# EAGLE design LPC_4TE_TOP_3_53d (EAGLE 5.04)

## Sheet 1 of 2
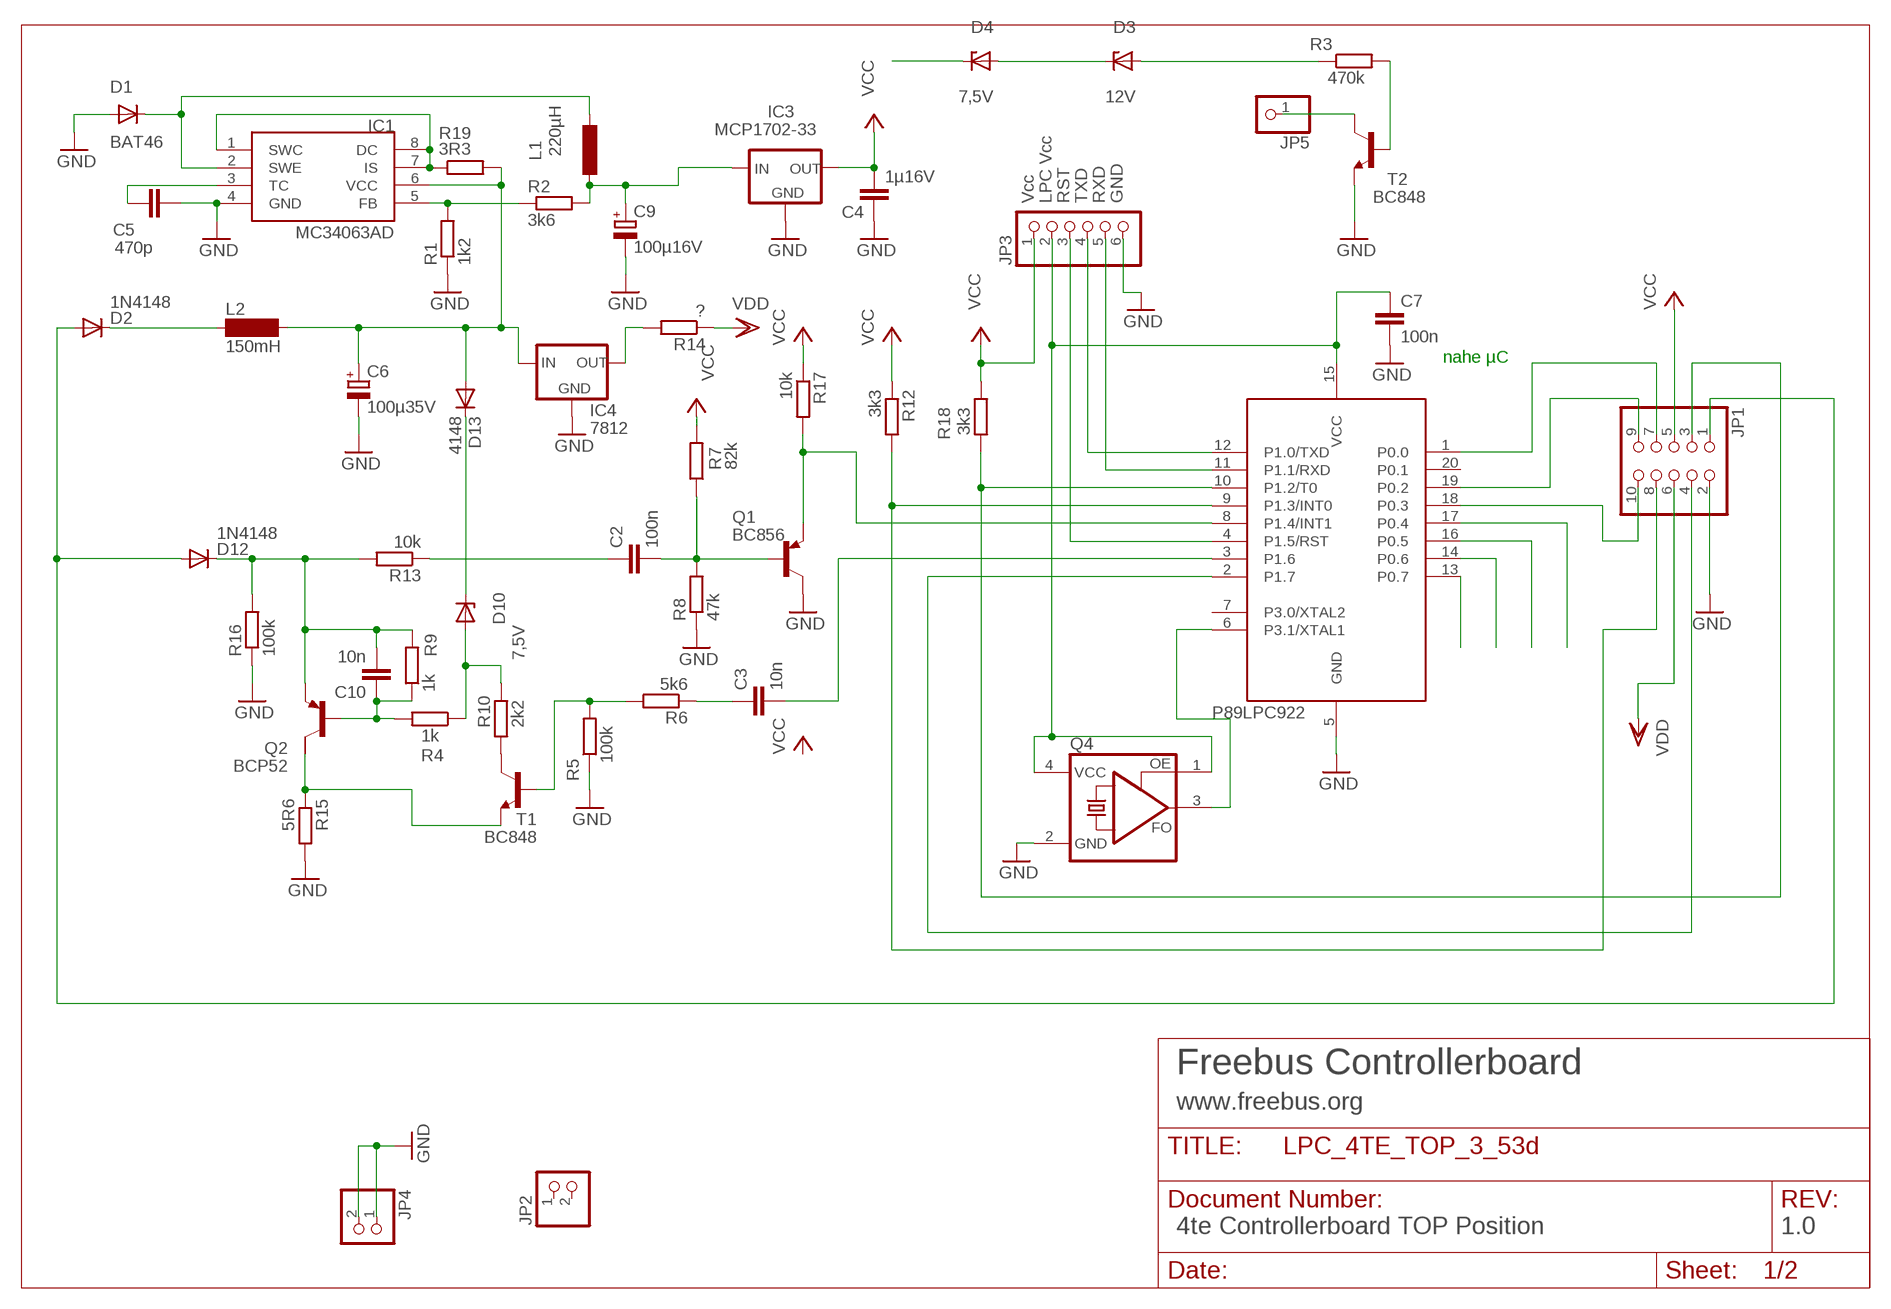
[diagram p0: schematic, sheet 1]

### Parts
C2  100n  C-EUC1206  [C1206]
C3  10n  C-EUC1206  [C1206]
C4  1µ16V  C-EUC1206  [C1206]
C5  470p  C-EUC1206  [C1206]
C6  100µ35V  CPOL-EUE5-8.5  [E5-8,5]
C7  100n  C-EUC1206  [C1206]
C9  100µ16V  CPOL-EUE2.5-5  [E2,5-5]
C10  10n  C-EUC1206  [C1206]
D1  BAT46  DIODE-MINIMELF  [MINIMELF]
D2  1N4148  DIODE-MINIMELF  [MINIMELF]
D3  12V  ZPD  [MINIMELF]
D4  7,5V  ZPD  [MINIMELF]
D10  7,5V  ZPD  [MINIMELF]
D12  1N4148  DIODE-MINIMELF  [MINIMELF]
D13  4148  DIODE-MINIMELF  [MINIMELF]
IC1  MC34063AD  [SOIC8]
IC3  MCP1702-33  79LXX  [79LXX]
IC4  7812  78XXS  [78XXS]
JP1  PINHD-2X5  [2X05]
JP2  PINHD-1X2  [1X02]
JP3  PINHD-1X6  [1X06]
JP4  PINHD-1X2  [1X02]
JP5  PINHD-1X1  [1X01]
L1  220µH  L-EU2200-11.43  [2200-11.43]
L2  150mH  SD12-1000  [SD12_1000]
Q1  BC856  BC856ALT1SMD  [SOT23-BEC]
Q2  BCP52  FZT753SMD  [SOT223]
Q4  ASFL  [ASF]
R1  1k2  R-EU_R1206  [R1206]
R2  3k6  R-EU_M1206  [M1206]
R3  470k  R-EU_R1206  [R1206]
R4  1k  R-EU_R1206  [R1206]
R5  100k  R-EU_R1206  [R1206]
R6  5k6  R-EU_R1206  [R1206]
R7  82k  R-EU_R1206  [R1206]
R8  47k  R-EU_M1206  [M1206]
R9  1k  R-EU_R1206  [R1206]
R10  2k2  R-EU_M1206  [M1206]
R12  3k3  R-EU_R1206  [R1206]
R13  10k  R-EU_R1206  [R1206]
R14  ?  R-EU_R1206  [R1206]
R15  5R6  R-EU_R1206  [R1206]
R16  100k  R-EU_M1206  [M1206]
R17  10k  R-EU_R1206  [R1206]
R18  3k3  R-EU_M1206  [M1206]
R19  3R3  R-EU_M1206  [M1206]
T1  BC848  [SOT23]
T2  BC848  [SOT23]
U1  89LPC922  [DIL20]

### Nets
DRAIN: R10.1 T1.3(C)
EIB+: D2.A D12.A JP1.1
EIB_DC: C6.+ D4.C D13.A IC1.6(VCC) IC4.IN L2.2 R19.2
EIB_SEND: C3.2 U1.3(P1.6)
EIBIN: Q1.E R17.2 U1.8(P1.4/INT1)
GATE: R5.2 R6.2 T1.1(B)
GND: C4.1 C5.2 C6.- C7.2 C9.- D1.A IC1.4(GND) IC3.GND IC4.GND JP1.2 JP3.6 JP4.1 JP4.2 Q1.C Q4.2(GND) R1.1 R5.1 R8.1 R15.2 R16.1 T2.2(E) U1.5(GND) ; also sheet 2
INT0: JP1.8 R12.2 U1.9(P1.3/INT0)
N$4: C10.1 Q2.1(B) R4.2 R9.1
N$5: C3.1 R6.1
N$6: C10.2 D12.C Q2.3(E) R9.2 R13.2 R16.2
N$7: Q2.2(C) R15.1 T1.2(E)
N$8: D2.C L2.1
N$9: JP3.5 U1.11(P1.1/RXD)
N$12: IC4.OUT R14.2
N$16: JP3.3 U1.4(P1.5/RST)
N$17: D3.C D4.A
N$19: D3.A R3.1
N$20: R3.2 T2.1(B)
N$21: JP5.1 T2.3(C)
N$24: JP3.4 U1.12(P1.0/TXD)
N$25: Q4.3(FO) U1.6(P3.1/XTAL1)
N$26: C9.+ IC3.IN L1.1 R2.2
N$31: C2.2 Q1.B R7.1 R8.2
N$50: IC1.5(FB) R1.2 R2.1
N$51: D1.C IC1.2(SWE) L1.2
N$52: C5.1 IC1.3(TC)
N$55: D10.A R4.1 R10.2
N$58: D10.C D13.C
N$63: IC1.1(SWC) IC1.7(IS) IC1.8(DC) R19.1
N$77: C2.1 R13.1
P0.0: JP1.7 U1.1(P0.0)
P0.2: JP1.9 U1.19(P0.2)
P0.3: JP1.10 U1.18(P0.3)
P04: U1.17(P0.4) ; also sheet 2
P05: U1.16(P0.5) ; also sheet 2
P06: U1.14(P0.6) ; also sheet 2
P07: U1.13(P0.7)
PROG: JP1.4 U1.2(P1.7)
PWM: JP1.3 R18.2 U1.10(P1.2/T0)
VCC: C4.2 IC3.OUT JP1.5 JP3.1 R7.2 R12.1 R17.1 R18.1 ; also sheet 2
VCC_LPC: C7.1 JP3.2 Q4.1(OE) Q4.4(VCC) U1.15(VCC)
VDD: JP1.6 R14.1
Unconnected: JP2.1 JP2.2 Q2.4(C/) U1.7(P3.0/XTAL2) U1.20(P0.1)

### Notes on the sheet
- Vcc | LPC Vcc | RST | TXD | RXD | GND
- nahe µC
- P89LPC922
- Freebus Controllerboard
- www.freebus.org
- 4te Controllerboard TOP Position | 1.0

## Sheet 2 of 2
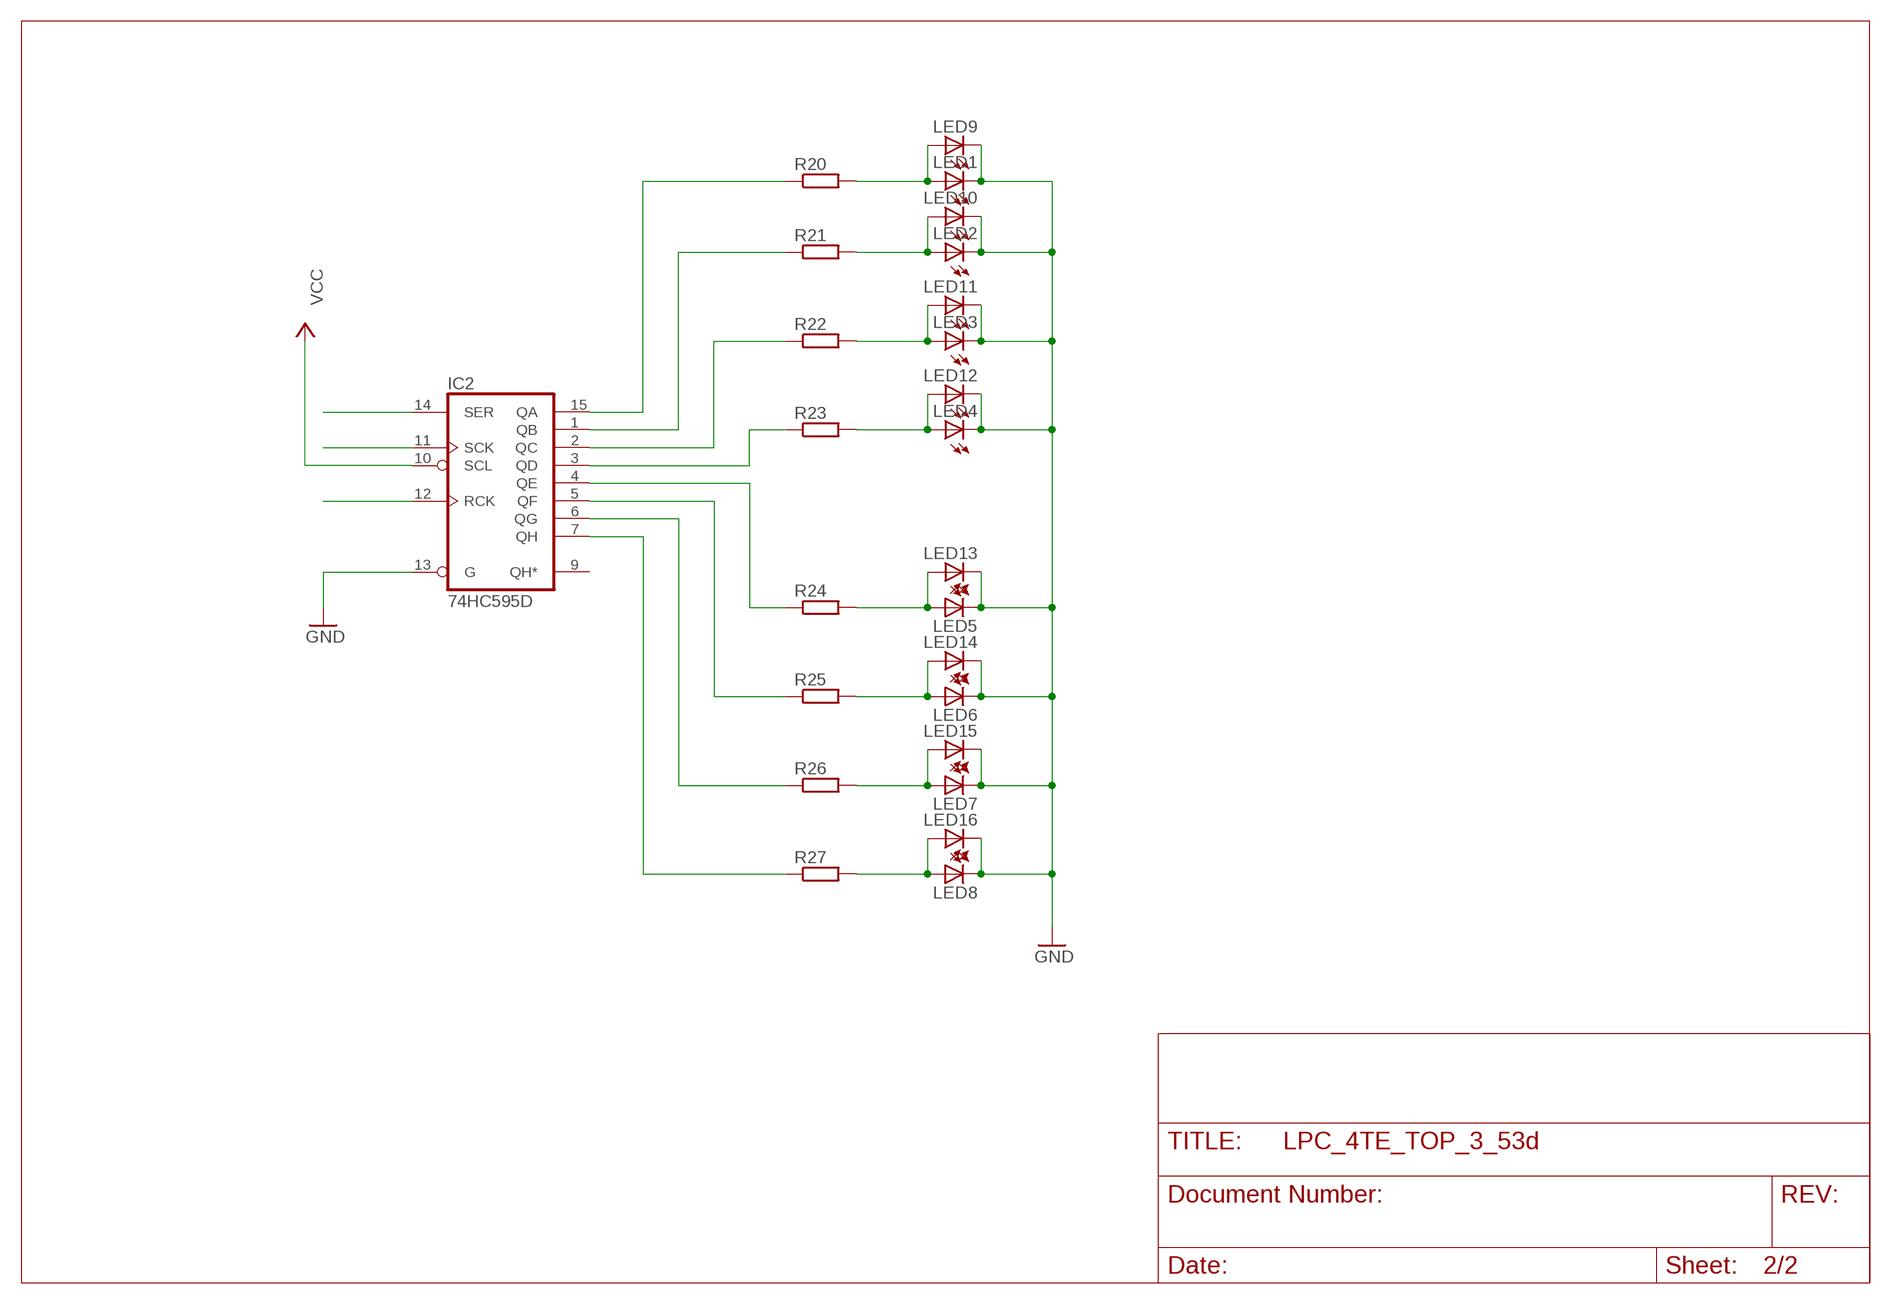
[diagram p1: schematic, sheet 2]

### Parts
IC2  74HC595D  [SO16]
LED1  LED3MM  [LED3MM]
LED2  LED3MM  [LED3MM]
LED3  LED3MM  [LED3MM]
LED4  LED3MM  [LED3MM]
LED5  LED3MM  [LED3MM]
LED6  LED3MM  [LED3MM]
LED7  LED3MM  [LED3MM]
LED8  LED3MM  [LED3MM]
LED9  LEDCHIPLED_1206  [CHIPLED_1206]
LED10  LEDCHIPLED_1206  [CHIPLED_1206]
LED11  LEDCHIPLED_1206  [CHIPLED_1206]
LED12  LEDCHIPLED_1206  [CHIPLED_1206]
LED13  LEDCHIPLED_1206  [CHIPLED_1206]
LED14  LEDCHIPLED_1206  [CHIPLED_1206]
LED15  LEDCHIPLED_1206  [CHIPLED_1206]
LED16  LEDCHIPLED_1206  [CHIPLED_1206]
R20  R-EU_R1206  [R1206]
R21  R-EU_R1206  [R1206]
R22  R-EU_R1206  [R1206]
R23  R-EU_R1206  [R1206]
R24  R-EU_R1206  [R1206]
R25  R-EU_R1206  [R1206]
R26  R-EU_R1206  [R1206]
R27  R-EU_R1206  [R1206]

### Nets
GND: IC2.13(G) LED1.K(C) LED2.K(C) LED3.K(C) LED4.K(C) LED5.K(C) LED6.K(C) LED7.K(C) LED8.K(C) LED9.C LED10.C LED11.C LED12.C LED13.C LED14.C LED15.C LED16.C ; also sheet 1
N$1: LED1.A LED9.A R20.2
N$2: LED2.A LED10.A R21.2
N$3: LED3.A LED11.A R22.2
N$10: LED4.A LED12.A R23.2
N$11: LED5.A LED13.A R24.2
N$13: LED6.A LED14.A R25.2
N$15: LED7.A LED15.A R26.2
N$18: LED8.A LED16.A R27.2
N$22: IC2.15(QA) R20.1
N$23: IC2.1(QB) R21.1
N$28: IC2.2(QC) R22.1
N$29: IC2.3(QD) R23.1
N$30: IC2.7(QH) R27.1
N$32: IC2.6(QG) R26.1
N$33: IC2.5(QF) R25.1
N$34: IC2.4(QE) R24.1
P04: IC2.14(SER) ; also sheet 1
P05: IC2.11(SCK) ; also sheet 1
P06: IC2.12(RCK) ; also sheet 1
VCC: IC2.10(SCL) ; also sheet 1
Unconnected: IC2.9(QH*)

## Power pins joined to a net without a drawn wire
GND: IC2.8(GND)
VCC: IC2.16(VCC)

## Library data of the parts
C2-C5 C7 C10 = rcl:C-EU: CAPACITOR, European symbol
C6 C9 = rcl:CPOL-EU: POLARIZED CAPACITOR, European symbol
D1 D2 D12 D13 = diode:DIODE-: DIODE
D3 D4 D10 = diode:ZPD: Z DIODE 500 mW
IC1 = mc34063:MC34063
IC2 = 74xx-eu:74*595: 8-bit SHIFT REGISTER, output latch
IC3 = v-reg:79LXX: VOLTAGE REGULATOR
IC4 = v-reg:78XXS: VOLTAGE REGULATOR
JP1 = pinhead:PINHD-2X5: PIN HEADER
JP2 JP4 = pinhead:PINHD-1X2: PIN HEADER
JP3 = pinhead:PINHD-1X6: PIN HEADER
JP5 = pinhead:PINHD-1X1: PIN HEADER
L1 = rcl:L-EU: INDUCTOR, European symbol
L2 = inductor-neosid:SD12: INDUCTOR nominal inductance
LED1-LED16 = led:LED: LED OSRAM: - CHIPLED LG R971, LG N971, LY N971, LG Q971, LY Q971, LO R971, LY R971 LH N974, LH R974 LS Q976, LO Q976, LY Q976 LO Q996 - Hyper CHIPLED LW Q18S LB Q993, LB Q99A, LB R99A - SideLED LS A670, LO A670, LY A670, LG A670, LP A670 LB A673, LV A673, LT A673, LW A673 LH A674 LY A675 LS A676, LA A676, LO A676, LY A676, LW A676 LS A679, LY A679, LG A679 - Hyper Micro SIDELED® LS Y876, LA Y876, LO Y876, LY Y876 LT Y87S - SmartLED LW L88C, LW L88S LB L89C, LB L89S, LG L890 LS L89K, LO L89K, LY L89K LS L896, LA L896, LO L896, LY L896 - TOPLED LS T670, LO T670, LY T670, LG T670, LP T670 LSG T670, LSP T670, LSY T670, LOP T670, LYG T670 LG T671, LOG T671, LSG T671 LB T673, LV T673, LT T673, LW T673 LH T674 LS T676, LA T676, LO T676, LY T676, LB T676, LH T676, LSB T676, LW T676 LB T67C, LV T67C, LT T67C, LS T67K, LO T67K, LY T67K, LW E67C LS E67B, LA E67B, LO E67B, LY E67B, LB E67C, LV E67C, LT E67C LW T67C LS T679, LY T679, LG T679 LS T770, LO T770, LY T770, LG T770, LP T770 LB T773, LV T773, LT T773, LW T773 LH T774 LS E675, LA E675, LY E675, LS T675 LS T776, LA T776, LO T776, LY T776, LB T776 LHGB T686 LT T68C, LB T68C - Hyper Mini TOPLED® LB M676 - Mini TOPLED Santana® LG M470 LS M47K, LO M47K, LY M47K Source: http://www.osram.convergy.de - LUMILED® LXK2-PW12-R00, LXK2-PW12-S00, LXK2-PW14-U00, LXK2-PW14-V00 LXK2-PM12-R00, LXK2-PM12-S00, LXK2-PM14-U00 LXK2-PE12-Q00, LXK2-PE12-R00, LXK2-PE12-S00, LXK2-PE14-T00, LXK2-PE14-U00 LXK2-PB12-K00, LXK2-PB12-L00, LXK2-PB12-M00, LXK2-PB14-N00, LXK2-PB14-P00, LXK2-PB14-Q00 LXK2-PR12-L00, LXK2-PR12-M00, LXK2-PR14-Q00, LXK2-PR14-R00 LXK2-PD12-Q00, LXK2-PD12-R00, LXK2-PD12-S00 LXK2-PH12-R00, LXK2-PH12-S00 LXK2-PL12-P00, LXK2-PL12-Q00, LXK2-PL12-R00 Source: www.luxeon.com
Q1 = transistor-pnp:BC856*: PNP Transistror
Q2 = transistor-pnp:FZT753SMD: PNP Transistor
Q4 = crystal:ASF*: CRYSTAL CLOCK OSCILLATORS 5.0 Vdc or 3.3 Vdc - LOW PROFILE ULTRA MINIATURE CERAMIC SURFACE MOUNT Source: http://www.abracon.com/Oscillators/asf1-L-L1.pdf
R1-R10 R12-R27 = rcl:R-EU_: RESISTOR, European symbol
T1 T2 = transistor:BC848: NPN TRANSISTOR
U1 = micro-philips:89LPC922

## Board
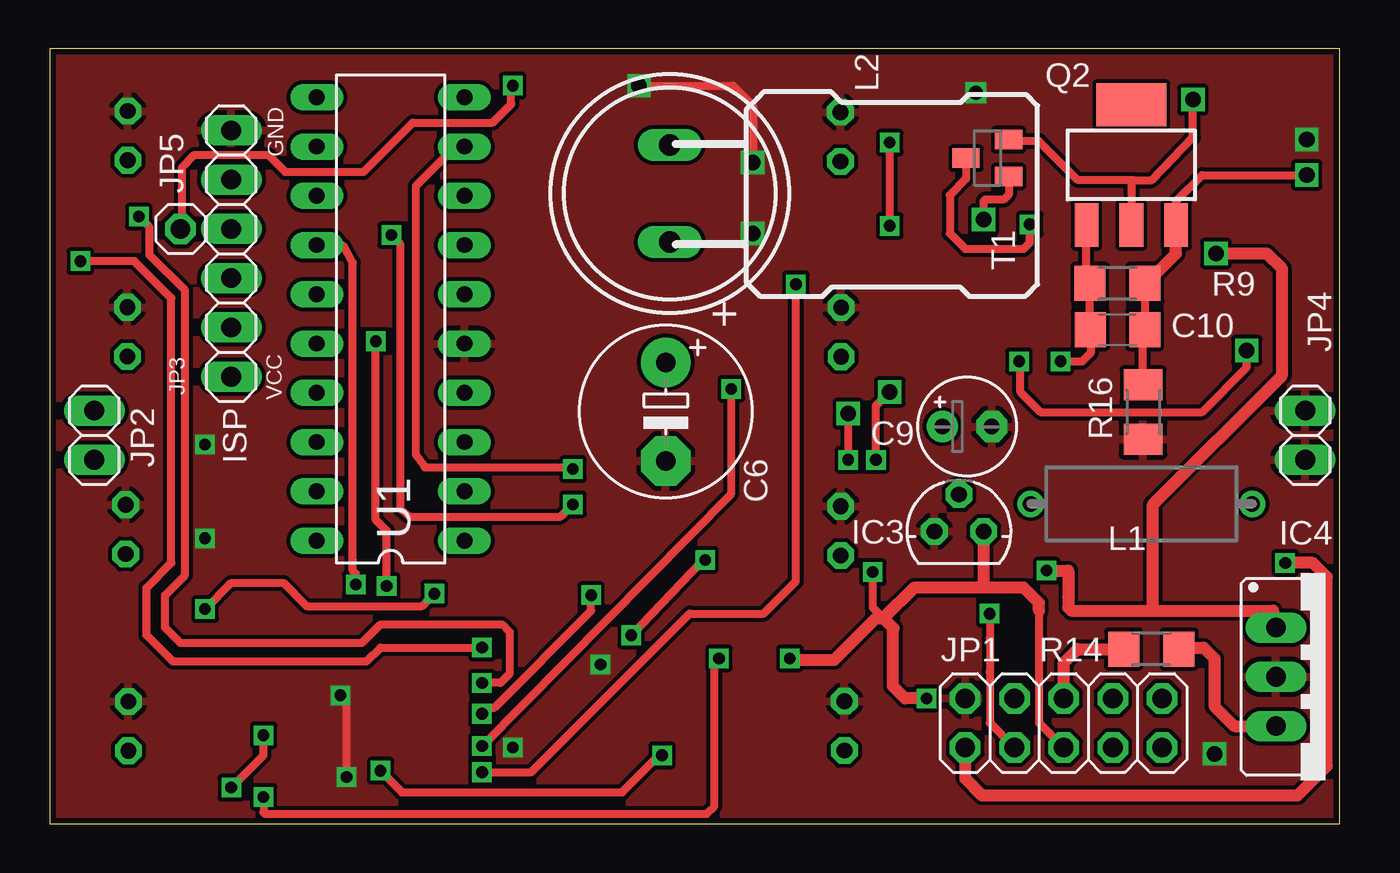
[diagram p2: board, top side]
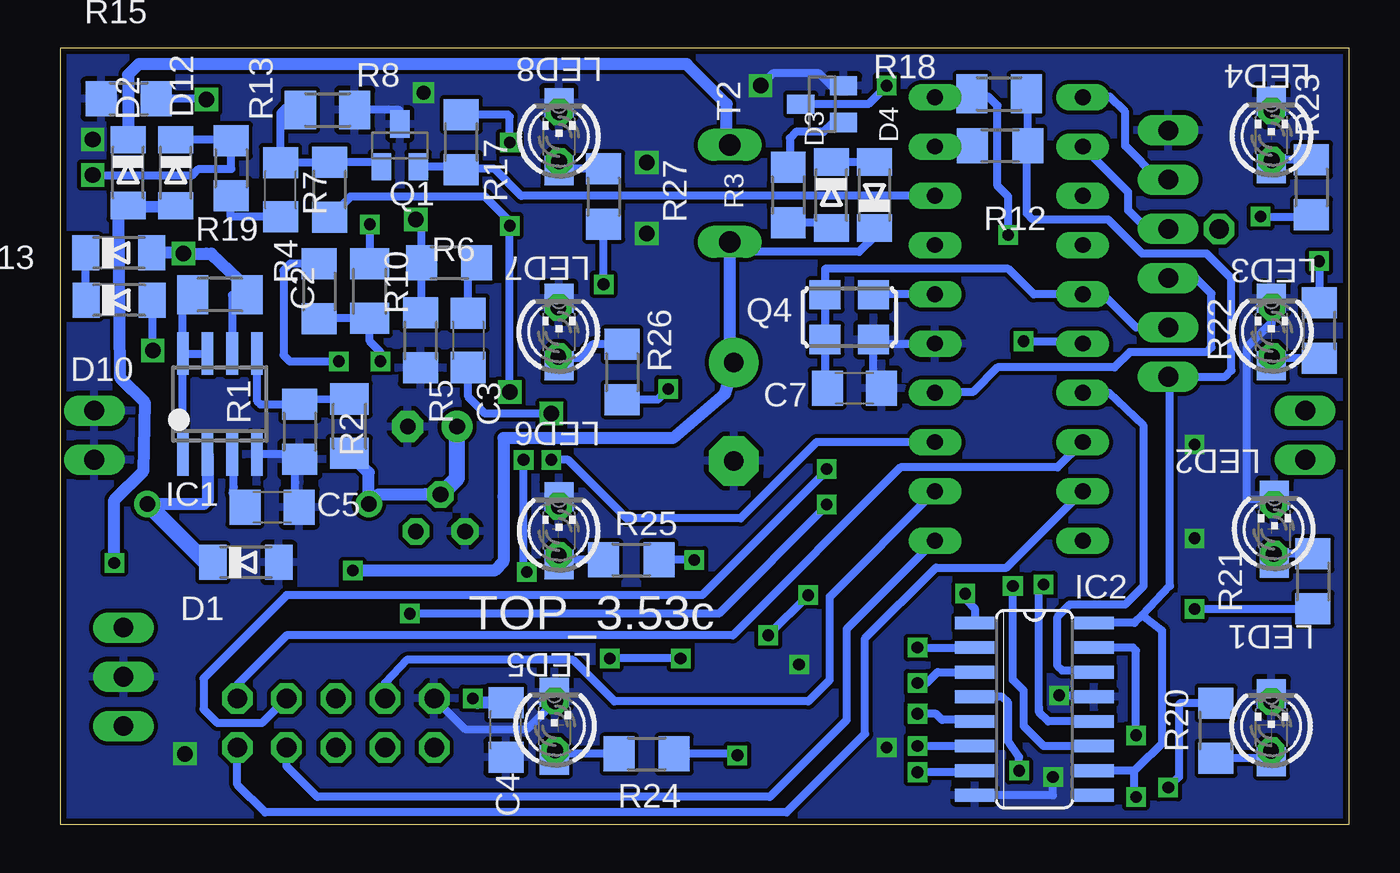
[diagram p3: board, bottom side, seen from below]

Size 66.5 x 40 mm. Coordinates in mm from the lower left corner, seen from the top.
Outline: 0,40 66.5,40 66.5,0 0,0 0,40
Copper layers (1*16): Top 0.035mm / dielectric 1.5mm / Bottom 0.035mm
Design rules: minimum track width 10mil, minimum drill 24mil, track to track 8mil, track to pad 8mil, pad to pad 8mil, via to via 8mil, smd to smd 8mil, copper to edge 12mil, drill to drill 8mil, minimum pad ring 11mil, minimum via ring 8mil, stop-mask expansion 4mil, vias tented up to drill 0mil, thermal gap 10mil

### Footprints (pad centres in the part's own frame; a part is rotated, then mirrored left to right if it is on the bottom)
C1206 = smd 1.6 x 1.8: 1 -1.4,0; 2 1.4,0
E5-8,5 = drill 1.016 pad 2.54: + -2.54,0 | drill 1.016 pad 2.54 octagon: - 2.54,0
E2,5-5 = drill 0.813 pad 1.6: + -1.27,0 | drill 0.813 pad 1.6 octagon: - 1.27,0
MINIMELF = smd 1.4 x 1.8: A 1.7,0; C -1.7,0
SOIC8 = smd 0.6 x 2.2: 1 -1.905,-2.6; 2 -0.635,-2.6; 3 0.635,-2.6; 4 1.905,-2.6; 5 1.905,2.6; 6 0.635,2.6; 7 -0.635,2.6; 8 -1.905,2.6
SO16 = smd 0.66 x 2.032: 1 -4.445,-3.073; 2 -3.175,-3.073; 3 -1.905,-3.073; 4 -0.635,-3.073; 5 0.635,-3.073; 6 1.905,-3.073; 7 3.175,-3.073; 8 4.445,-3.073; 9 4.445,3.073; 10 3.175,3.073; 11 1.905,3.073; 12 0.635,3.073; 13 -0.635,3.073; 14 -1.905,3.073; 15 -3.175,3.073; 16 -4.445,3.073
79LXX = drill 0.813 octagon: GND -1.27,0; IN 0,1.905; OUT 1.27,0
78XXS = drill 1.016 long: GND 0,-2.54; IN -2.54,-2.54; OUT 2.54,-2.54
2X05 = drill 1.016 octagon: 1 -5.08,-1.27; 2 -5.08,1.27; 3 -2.54,-1.27; 4 -2.54,1.27; 5 0,-1.27; 6 0,1.27; 7 2.54,-1.27; 8 2.54,1.27; 9 5.08,-1.27; 10 5.08,1.27
1X02 = drill 1.016 long: 1 -1.27,0; 2 1.27,0
1X06 = drill 1.016 long: 1 -6.35,0; 2 -3.81,0; 3 -1.27,0; 4 1.27,0; 5 3.81,0; 6 6.35,0
1X01 = drill 1.016 octagon: 1 0,0
2200-11.43 = drill 0.8 pad 1.27: 1 -5.715,0; 2 5.715,0
SD12_1000 = drill 1.1 long: 1 -2.5,0; 2 2.5,0
LED3MM = drill 0.813 octagon: A -1.27,0; K 1.27,0
CHIPLED_1206 = smd 1.5 x 1.5: A 0,-1.75; C 0,1.75
SOT23-BEC = smd 1 x 1.4: B -0.95,-1.1; C 0,1.1; E 0.95,-1.1
SOT223 = smd 1.219 x 2.235: 1 -2.311,-3.099; 2 0,-3.099; 3 2.311,-3.099 | smd 3.6 x 2.2: 4 0,3.099
ASF = smd 1.6 x 1.5: 1 -1.25,-1.15; 2 1.25,-1.15; 3 1.25,1.15; 4 -1.25,1.15
R1206 = smd 1.6 x 1.803: 1 -1.422,0; 2 1.422,0
M1206 = smd 1.6 x 2: 1 -1.4,0; 2 1.4,0
SOT23 = smd 1 x 1.4: 1 -0.95,-1.1; 2 0.95,-1.1; 3 0,1.1
DIL20 = drill 0.813 long: 1 -11.43,-3.81; 2 -8.89,-3.81; 3 -6.35,-3.81; 4 -3.81,-3.81; 5 -1.27,-3.81; 6 1.27,-3.81; 7 3.81,-3.81; 8 6.35,-3.81; 9 8.89,-3.81; 10 11.43,-3.81; 11 11.43,3.81; 12 8.89,3.81; 13 6.35,3.81; 14 3.81,3.81; 15 1.27,3.81; 16 -1.27,3.81; 17 -3.81,3.81; 18 -6.35,3.81; 19 -8.89,3.81; 20 -11.43,3.81

### Placement (x,y rotation side)
C2  55.13,32.72 90 bottom
C3  45.45,24.95 270 bottom
C4  43.5,4.86 90 bottom
C5  55.56,16.35 0 bottom
C6  31.75,21.27 270 top
C7  25.53,22.49 0 bottom
C9  47.3,20.51 0 top
C10  55.05,25.51 0 top
D1  56.92,13.5 0 bottom
D2  62.99,33.6 270 bottom
D3  26.72,32.44 270 bottom
D4  24.5,32.44 90 bottom
D10  63.46,27.03 0 bottom
D12  60.53,33.59 270 bottom
D13  63.47,29.46 0 bottom
IC1  58.26,21.67 0 bottom
IC2  16.24,5.93 270 bottom
IC3  46.88,15.1 0 top
IC4  65.77,7.6 270 top
JP1  52.28,5.22 0 top
JP2  2.27,20.06 90 top
JP3  9.34,29.43 90 top
JP4  64.74,20.06 90 top
JP5  6.72,30.7 0 top
L1  56.29,16.52 0 top
L2  31.96,32.53 270 top
LED1  4.03,5.06 90 bottom
LED2  3.89,15.2 90 bottom
LED3  3.98,25.39 90 bottom
LED4  4,35.5 90 bottom
LED5  40.97,5.07 90 bottom
LED6  40.78,15.13 90 bottom
LED7  40.8,25.38 90 bottom
LED8  40.77,35.45 90 bottom
LED9  4.02,4.98 0 bottom
LED10  3.86,15.22 0 bottom
LED11  4.02,25.38 0 bottom
LED12  4.02,35.54 0 bottom
LED13  41.01,5.06 0 bottom
LED14  40.77,15.14 0 bottom
LED15  40.77,25.38 0 bottom
LED16  40.77,35.46 0 bottom
Q1  48.97,35 0 bottom
Q2  55.77,34 0 top
Q4  25.79,26.14 0 bottom
R1  54.13,20.24 90 bottom
R2  51.58,20.53 270 bottom
R3  28.94,32.44 90 bottom
R4  53.14,27.48 90 bottom
R5  47.91,24.95 90 bottom
R6  46.43,28.95 180 bottom
R7  52.59,32.72 270 bottom
R8  52.71,36.83 180 bottom
R9  55.05,27.89 0 top
R10  50.53,27.49 270 bottom
R12  18.01,34.99 180 bottom
R13  57.67,33.83 90 bottom
R14  56.8,9.03 0 top
R15  62.97,37.4 180 bottom
R16  56.37,21.25 90 top
R17  45.81,35.17 270 bottom
R18  18.06,37.66 180 bottom
R19  58.26,27.31 0 bottom
R20  6.87,4.82 270 bottom
R21  1.87,12.52 90 bottom
R22  1.56,25.46 270 bottom
R23  1.95,32.84 90 bottom
R24  36.24,3.63 180 bottom
R25  37.04,13.63 180 bottom
R26  37.51,23.32 90 bottom
R27  38.47,32.36 90 bottom
T1  48.34,34.35 90 top
T2  27.19,37.13 90 bottom
U1  17.56,26.05 90 top

### Tracks (layer width: path | path; a pad name or v marks a point on that pad's centre or on a via)
DRAIN  (via drill 0.6)
  Top 0.406: T1.3 47.24,33.28 46.4,32.44 46.4,30.46 47.2,29.67 50.21,29.67 50.53,29.98 v50.53,30.94
  Bottom 0.406: v50.53,30.94 R10.1
EIB+  (via drill 0.6)
  Top 0.61: JP1.1 47.2,2.36 48.07,1.49 64.34,1.49 65.85,3 65.85,12.76 65.14,13.47 v63.71,13.47 63.87,13.31
  Bottom 0.61: D12.A 60.68,31.82 D2.A 63.47,31.74 63.39,23 62.12,21.73 62.2,18.24 63.71,16.73 v63.71,13.47
EIB_DC  (via drill 0.6, 0.8)
  Top 0.61: v51.4,13.08 52.52,13.08 52.52,11.73 52.52,11.17 52.67,11.01 56.88,11.01 | 56.88,11.01 63.07,11.01 IC4.IN | 56.88,11.01 56.88,16.49 63.55,23.16 63.55,28.63 62.75,29.43 v60.14,29.43
  Bottom 0.406: IC1.6 57.63,27.28 R19.2 | D4.C 24.5,30.3 25.29,29.51 31.44,29.51 L2.2 | D13.A 61.37,29.46 61.25,29.59
  Bottom 0.61: R19.2 56.86,27.66 58.71,29.43 58.94,29.43 v60.14,29.43 60.17,29.46 D13.A | L2.2 31.96,23.68 C6.+ 32.23,22.17 34.89,19.9 43.63,19.9 43.63,16.89 43.63,13.55 44.1,13.08 v51.4,13.08
EIB_SEND  (via drill 0.6, 0.8)
  Top 0.406: v41.16,18.79 v41.16,21.17
  Bottom 0.406: U1.3 27.47,19.7 31.4,15.78 37.28,15.78 40.29,18.79 v41.16,18.79 | v41.16,21.17 44.58,21.17 45.45,22.05 45.45,23.23 C3.2
EIBIN
  Bottom 0.406: Q1.E 45.96,33.9 R17.2 | R17.2 45.42,33.75 | U1.8 42.71,32.4 44.1,33.79 45.76,33.79 R17.2
GATE  (via drill 0.8)
  Top 0.406: T1.1 49.44,32.47 49.18,32.21 48.23,32.21 48.15,32.13 v48.15,31.17
  Bottom 0.406: v48.15,31.17 47.85,31 R6.2 47.85,26.79 R5.2
GND  (via drill 0.6, 0.7, 0.8)
  Top 0.406: v14.97,6.65 15.29,6.09 v15.29,2.44 | v30.37,38.08 35.21,38.08 36.24,37.05 v36.24,34.11
  Bottom 0.406: C5.2 54.4,16.72 54.37,17.62 54.37,18.9 R1.1 | IC1.4 54.38,19.07 R1.1 | R1.1 53.98,19.29 | R8.1 49.01,36.83 49.02,36.77 49.02,36.15 Q1.C | 4.02,25.86 3.94,26.33 4.02,26.41 4.02,25.86 | 4.02,25.86 3.91,26.73 LED3.K | LED2.K 3.89,16.76 5.29,16.73 5.29,24.59 4.02,25.86 | LED2.K 3.89,16.44 | LED1.K 3.95,6.41 | U1.5 24.33,24.78 Q4.2 24.54,22.5 C7.2 | 41.11,6.49 LED5.K 42.41,4.9 45.61,4.9 JP1.2 | LED9.C 4.02,6.89 4.03,6.9 | LED10.C 3.86,16.5 LED2.K | IC2.13 13.25,6.65 v14.97,6.65 | v15.29,2.44 15.29,1.49 IC2.8 | T2.2 26.72,38.08 27.35,38.71 29.73,38.71 v30.37,38.08 | JP1.2
  other vias: 47.75,37.72 36.24,30.46 60.06,3.63 64.82,35.3 7.99,19.59 7.99,14.74 23.86,3.95 28.39,8.23
  pour Top: -0.75,41.33 66.25,41.33 67.76,39.83 67.76,0.38 66.33,-1.05 -0.51,-1.05 -1.14,-0.42
  pour Bottom: -0.98,42.68 67.28,42.68 68.31,41.65 68.31,0.38 66.8,-1.13 -0.9,-1.13 -1.38,-0.66
INT0  (via drill 0.6)
  Top 0.406: U1.9 20.88,34.94 18.86,32.92 18.86,19.03 19.34,18.39 26.72,18.39 v26.96,18.32
  Bottom 0.406: R12.2 21.34,34.91 U1.9 | v26.96,18.32 26.96,18.24 33.39,11.81 54.82,11.81 59.1,7.52 59.1,5.93 58.39,5.22 56.09,5.22 JP1.8
N$1
  Bottom 0.406: LED9.A 4.02,3.77 LED1.A 4.42,3.4 R20.2
N$2
  Bottom 0.406: LED10.A 3.86,13.9 LED2.A 3.88,13.94 R21.2
N$3
  Bottom 0.406: LED11.A 4.02,24.08 LED3.A 3.9,24.04 R22.2
N$4  (via drill 0.6)
  Top 0.406: Q2.1 53.46,28.06 R9.1 53.63,25.53 C10.1 53.71,25.45 53.71,24.35 53.23,23.87 v52.12,23.87
  Bottom 0.406: R4.2 54.63,28.9 54.98,28.55 54.98,24.19 54.66,23.87 v52.12,23.87
N$5
  Bottom 0.406: R6.1 45.45,28.84 C3.1
N$6  (via drill 0.8)
  Top 0.406: R9.2 56.48,25.53 C10.2 56.37,25.42 R16.2 | v64.82,33.48 59.42,33.48 58.07,32.13 58.07,31.97 58.08,31.96 Q2.3
  Top 0.61: R9.2 56.53,27.89 58.07,29.43 Q2.3
  Bottom 0.406: D12.C 57.79,35.29 57.67,35.5 R13.2 57.67,33.8 57.67,33.79 59.34,33.79 59.66,33.48 v64.82,33.48
N$7  (via drill 0.8)
  Top 0.406: Q2.2 55.77,33.14 55.85,33.22 | 55.85,33.22 56.82,33.22 58.94,35.42 v58.94,37.37 | 55.85,33.22 53.01,33.22 51.01,35.22 49.52,35.22 T1.2
  Bottom 0.406: v58.94,37.37 58.98,37.4 R15.1
N$8
  Bottom 0.61: D2.C 62.99,38.63 62.44,39.19 34.18,39.19 32.12,37.13 32.12,35.18 L2.1
N$9
  Bottom 0.406: JP3.5 9.81,33.24 11.56,34.98 11.56,36.73 12.35,37.52 13.71,37.52 U1.11
N$10
  Bottom 0.406: LED12.A 4.02,34.22 LED4.A 3.97,34.26 R23.2
N$11
  Bottom 0.406: LED13.A 41.01,3.76 LED5.A 40.8,3.63 R24.2
N$12
  Top 0.61: IC4.OUT 61.09,5.06 60.06,6.09 60.06,8.55 59.5,9.11 58.3,9.11 R14.2
N$13
  Bottom 0.406: LED14.A 40.77,13.85 LED6.A 40.55,13.63 R25.2
N$15
  Bottom 0.406: LED15.A 40.77,24.07 LED7.A 40.72,24.03 39.74,24.03 39.03,24.74 R26.2
N$16
  Bottom 0.406: JP3.3 7.91,28.16 7.11,27.36 7.11,24.59 7.35,24.35 11.32,24.35 12.11,23.55 18.15,23.55 19.42,22.28 21.33,22.28 U1.4
N$17
  Bottom 0.406: D4.A D3.C | D4.A
N$18
  Bottom 0.406: LED8.A LED16.A 40.69,33.79 R27.2
N$19
  Bottom 0.406: R3.1 27,31.02 D3.A
N$20
  Bottom 0.406: R3.2 28.86,33.95 28.86,35.38 28.54,35.7 27.12,35.7 26.64,36.18 T2.1
N$21  (via drill 0.6)
  Top 0.406: JP5.1 6.8,30.7 6.8,33.87 7.43,34.51 11.24,34.51 12.11,33.63 16.16,33.63 18.7,36.17 22.83,36.17 23.78,37.13 23.78,38 v23.86,38.08
  Bottom 0.406: 24.09,38.08 v23.86,38.08 24.81,37.13 T2.3
N$22  (via drill 0.6)
  Top 0.406: v11,4.58 11,3.55 v9.34,1.88
  Bottom 0.406: IC2.15 11.16,9.11 11,8.95 11,4.66 10.92,4.58 v11,4.58 | v9.34,1.88 8.78,2.44 8.78,6.17 8.71,6.24 R20.1
N$23  (via drill 0.6)
  Top 0.406: v7.99,11.09 9.34,12.44 12.03,12.44 13.22,11.25 19.18,11.25 v19.81,11.89
  Bottom 0.406: v7.99,11.09 1.88,11.09 R21.1 | IC2.1 19.31,11.11 19.81,11.61 v19.81,11.89
N$24
  Bottom 0.406: JP3.4 10.45,30.7 11.4,31.65 11.4,32.59 U1.12
N$25
  Bottom 0.406: U1.6 24.51,27.32 Q4.3
N$26
  Bottom 0.61: 47.67,17.02 IC3.IN 50.09,17 L1.1 50.58,18.13 R2.2
  Bottom 0.813: IC3.IN 46.03,17.85 C9.+
N$28  (via drill 0.6)
  Top 0.406: v1.56,29.03 4.33,29.03 6.24,27.13 6.24,13.47 4.97,12.2 4.97,9.74 6.32,8.39 16.32,8.39 17.03,9.11 v22.27,9.11
  Bottom 0.406: v1.56,29.03 R22.1 | v1.56,29.03 | v22.27,9.11 IC2.2 | IC2.2
N$29  (via drill 0.6)
  Top 0.406: v4.57,31.33 5.13,30.78 5.13,29.35 6.95,27.52 6.95,12.84 5.92,11.81 5.92,10.14 6.72,9.35 16.08,9.35 17.03,10.3 23.31,10.3 23.7,9.9 23.7,7.76 23.23,7.28 v22.27,7.28
  Bottom 0.406: v4.57,31.33 2.04,31.33 R23.1 | v22.27,7.28 21.8,7.28 21.24,7.84 IC2.3 | IC2.3
N$30  (via drill 0.6)
  Top 0.406: v22.27,2.68 24.81,2.68 25.45,3.31 32.99,10.85 36.8,10.85 38.47,12.52 v38.47,27.84
  Bottom 0.406: IC2.7 19.39,2.68 v22.27,2.68 | v38.47,27.84 R27.1
N$31
  Bottom 0.406: R8.2 54.17,36.92 54.89,36.92 55.13,36.69 C2.2 52.57,34.12 R7.1 50.16,34.14 Q1.B
N$32  (via drill 0.6)
  Top 0.406: v22.27,4.03 35.13,17.05 v35.13,22.44
  Bottom 0.406: IC2.6 | IC2.6 v22.27,4.03 | v35.13,22.44 35.68,21.89 R26.1
N$33  (via drill 0.6)
  Top 0.406: v22.27,5.69 22.04,6.01 22.91,6.01 27.91,11.01 v27.91,11.81 | v29.97,9.74 33.62,13.55 v33.78,13.63
  Bottom 0.406: IC2.5 19.39,5.38 21,5.38 21.32,5.69 v22.27,5.69 | v27.91,11.81 v29.97,9.74 | v33.78,13.63 R25.1
N$34  (via drill 0.6)
  Top 0.406: v17.03,2.76 18.15,1.65 29.5,1.65 31.4,3.55 v31.56,3.55
  Bottom 0.406: IC2.4 | IC2.4 17.91,6.57 17.59,6.25 17.59,4.27 17.03,3.47 v17.03,2.76 | v31.56,3.55 31.64,3.63 R24.1
N$50
  Bottom 0.406: R2.1 54.26,21.85 R1.2 54.15,21.65 56.17,21.65 56.36,21.84 IC1.5
N$51
  Bottom 0.61: IC1.2 58.87,19.04 58.87,16.73 59.08,16.52 L1.2
  Bottom 0.813: D1.C 58.99,13.5 L1.2
N$52
  Bottom 0.406: C5.1 57.6,17.02 57.55,17.38 57.55,18.99 IC1.3
N$55  (via drill 0.6, 0.8)
  Top 0.406: v61.72,24.43 61.72,23.55 59.42,21.25 51.09,21.25 50.05,22.28 50.05,23.79 v49.98,23.87
  Bottom 0.406: v61.72,24.43 61.72,26.99 D10.A | R4.1 53.1,26.09 R10.2 50.53,24.9 49.98,24.35 v49.98,23.87
N$58
  Bottom 0.406: D13.C 65.17,26.8 D10.C
N$63
  Bottom 0.406: IC1.8 60.17,26.86 R19.1 | IC1.8 IC1.7 | IC1.1 IC1.8
N$77
  Bottom 0.406: C2.1 57.69,31.32 R13.1
P0.0
  Bottom 0.406: U1.1 25.92,10.07 25.92,5.38 29.89,1.41 53.23,1.41 54.82,3 JP1.7
P0.2
  Bottom 0.406: U1.19 17.67,13.24 21.32,13.24 24.97,9.58 24.97,4.66 29.02,0.61 55.93,0.61 57.36,2.04 JP1.9
P0.3
  Bottom 0.406: U1.18 15.06,18.39 23.15,18.39 31.8,9.74 54.82,9.74 57.36,7.2 JP1.10
P04
  Bottom 0.406: U1.17 12.39,22.24 10.61,20.54 10.61,12.28 11.56,11.33 14.42,11.33 15.05,10.7 15.05,8.16 14.81,7.92 13.25,7.92 IC2.14
P05  (via drill 0.6)
  Top 0.406: v17.35,12.28 17.35,15.14 16.8,15.7 v16.8,24.9
  Bottom 0.406: v16.8,24.9 13.87,24.9 U1.16 | IC2.11 15.76,4.03 16.8,5.06 16.8,6.89 17.35,7.44 v17.35,12.28
P06  (via drill 0.6)
  Top 0.406: U1.14 13.79,29.82 15.13,29.82 15.61,28.95 15.61,13.63 15.61,13.08 15.76,12.92 v15.76,12.36
  Bottom 0.406: IC2.12 15.53,5.3 16,5.77 16,5.85 16,6.01 16,12.2 v15.76,12.36
PROG
  Bottom 0.406: U1.2 26.8,11.73 26.8,7.44 27.91,6.33 37.91,6.33 40.05,8.47 48.63,8.47 49.74,7.28 JP1.4
PWM  (via drill 0.6)
  Top 0.406: v26.96,16.49 26.32,15.85 18.54,15.85 18.07,16.25 18.07,29.9 v17.59,30.38 | v48.47,10.85 48.47,9.58 48.47,7.84 48.47,5.22 JP1.3
  Bottom 0.406: R18.2 21.31,37.42 U1.10 21.33,37.52 18.62,37.52 18.15,37.05 18.15,32.92 17.59,32.36 v17.59,30.38 | v26.96,16.49 26.96,16.41 32.51,10.85 v48.47,10.85
VCC  (via drill 0.6, 0.8)
  Top 0.406: JP1.5 51.01,5.22 51.01,11.01 | v43.31,30.86 v43.31,35.14 | v42.43,13 42.43,11.17 42.99,10.61 | v11,1.41 11,0.61 11.08,0.54 33.86,0.54 34.26,0.93 34.26,8.31 v34.5,8.55 | v42.59,18.79 42.59,21.57 v43.31,22.28
  Top 0.61: v38.15,8.55 38.31,8.47 40.45,8.47 42.59,10.61 42.99,10.61 | 51.01,11.01 51.01,11.41 50.21,12.2 48.31,12.2 | 48.31,12.2 44.58,12.2 42.99,10.61 | IC3.OUT 48.15,12.36 48.31,12.2 | 42.99,10.61 43.5,10.1 43.47,10.07 43.47,7.12 44.1,6.49 v45.21,6.49
  Bottom 0.406: 45.75,36.59 R17.1 43.41,36.59 43.31,36.49 v43.31,35.14 | R18.1 16.59,37.34 R12.1 16.64,34.86 16.64,31.49 16.32,31.17 12.43,31.17 10.68,29.43 7.35,29.43 6.08,28.16 6.08,23.4 6.4,23.08 8.46,23.08 JP3.1 9.26,23 9.26,12.28 10.68,10.77 | v42.59,18.79 42.59,13.16 v42.43,13 | IC2.16 11.08,10.38 10.68,10.77 | 11.08,2.76 IC2.10 | 11.08,2.76 10.84,3 | 10.84,3 | 10.84,3 9.65,4.19 9.65,9.98 10.68,10.77 | v11,1.41 11.08,1.49 11.08,2.76 | v34.5,8.55 v38.15,8.55 | v43.31,22.28 v43.31,30.86 43.31,31.09 44.58,32.36 51.52,32.36 R7.2
  Bottom 0.61: C4.2 44.99,6.26 v45.21,6.49
VCC_LPC
  Bottom 0.406: JP3.2 11,25.62 12.75,27.36 13.71,27.36 U1.15 16.28,27.32 17.59,28.63 27.04,28.63 Q4.4 Q4.1 27.04,22.78 C7.1
VDD
  Top 0.61: JP1.6 52.28,8.31 52.99,9.03 R14.1

### Text on the board
tPlace: +
bPlace: TOP_3.53c
tNames: GND | VCC | ISP